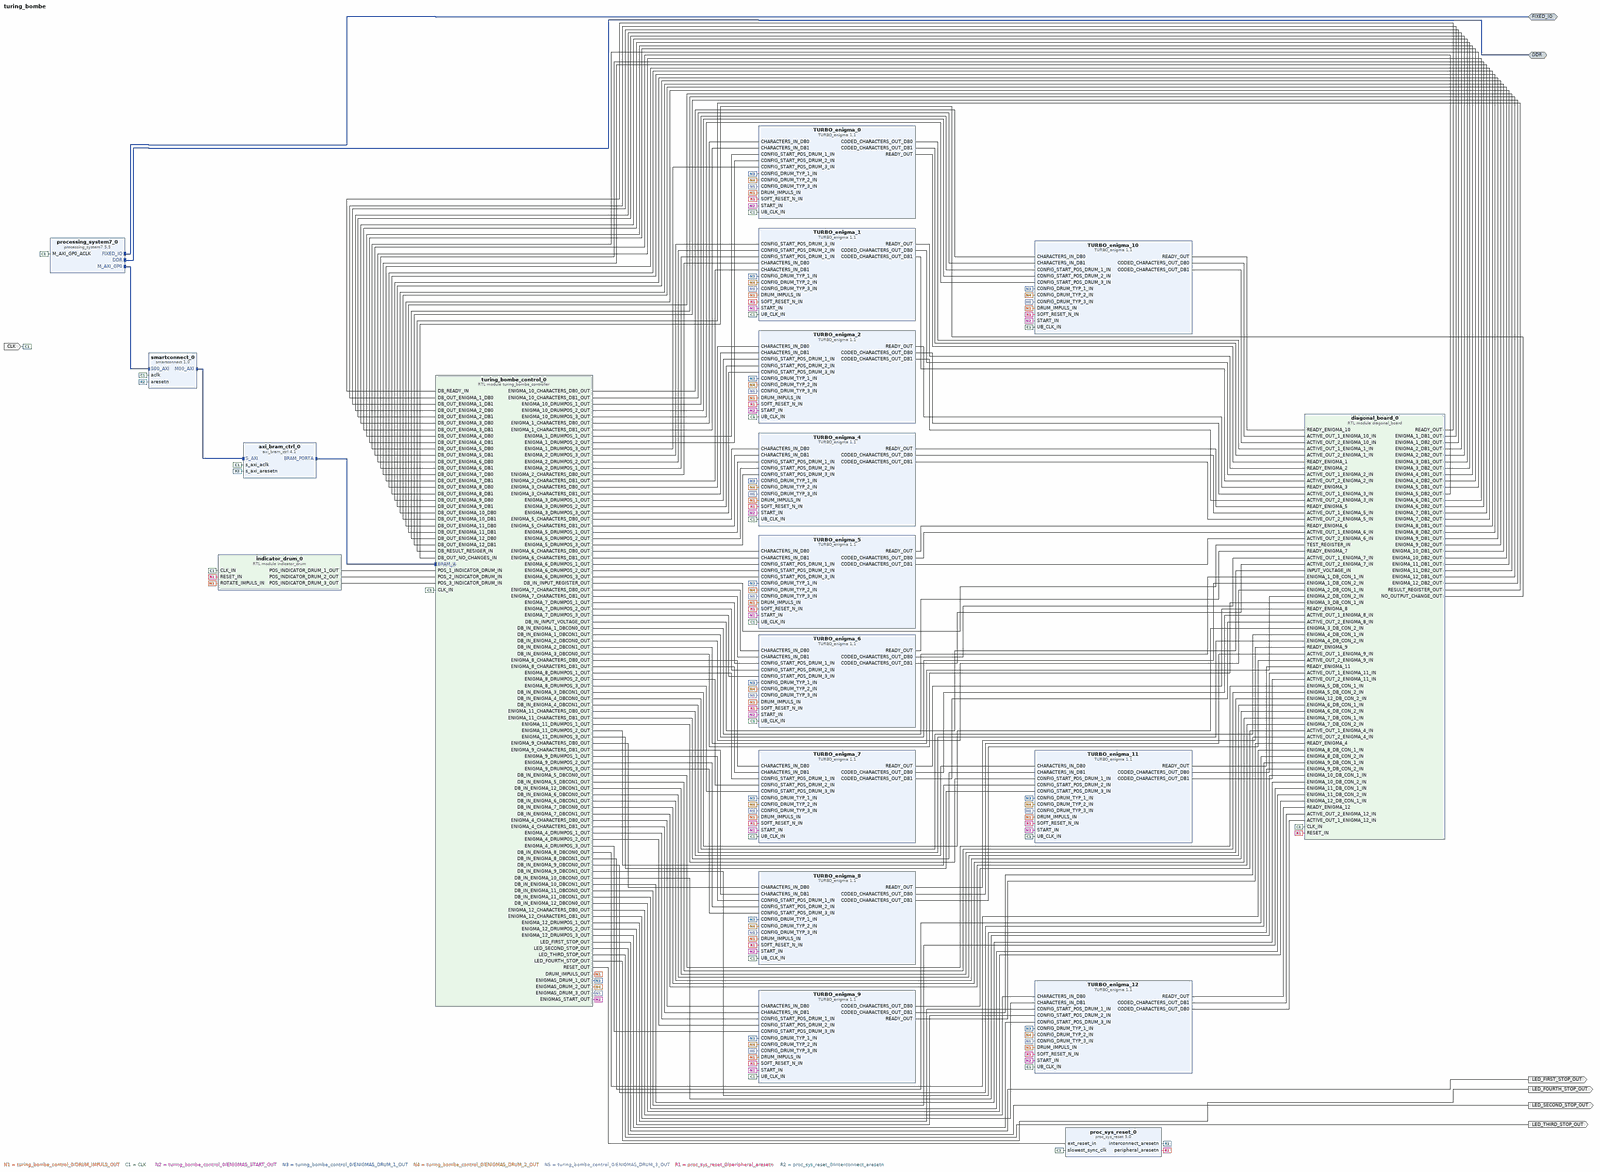
[diagram p0: block diagram of the top level, whole]
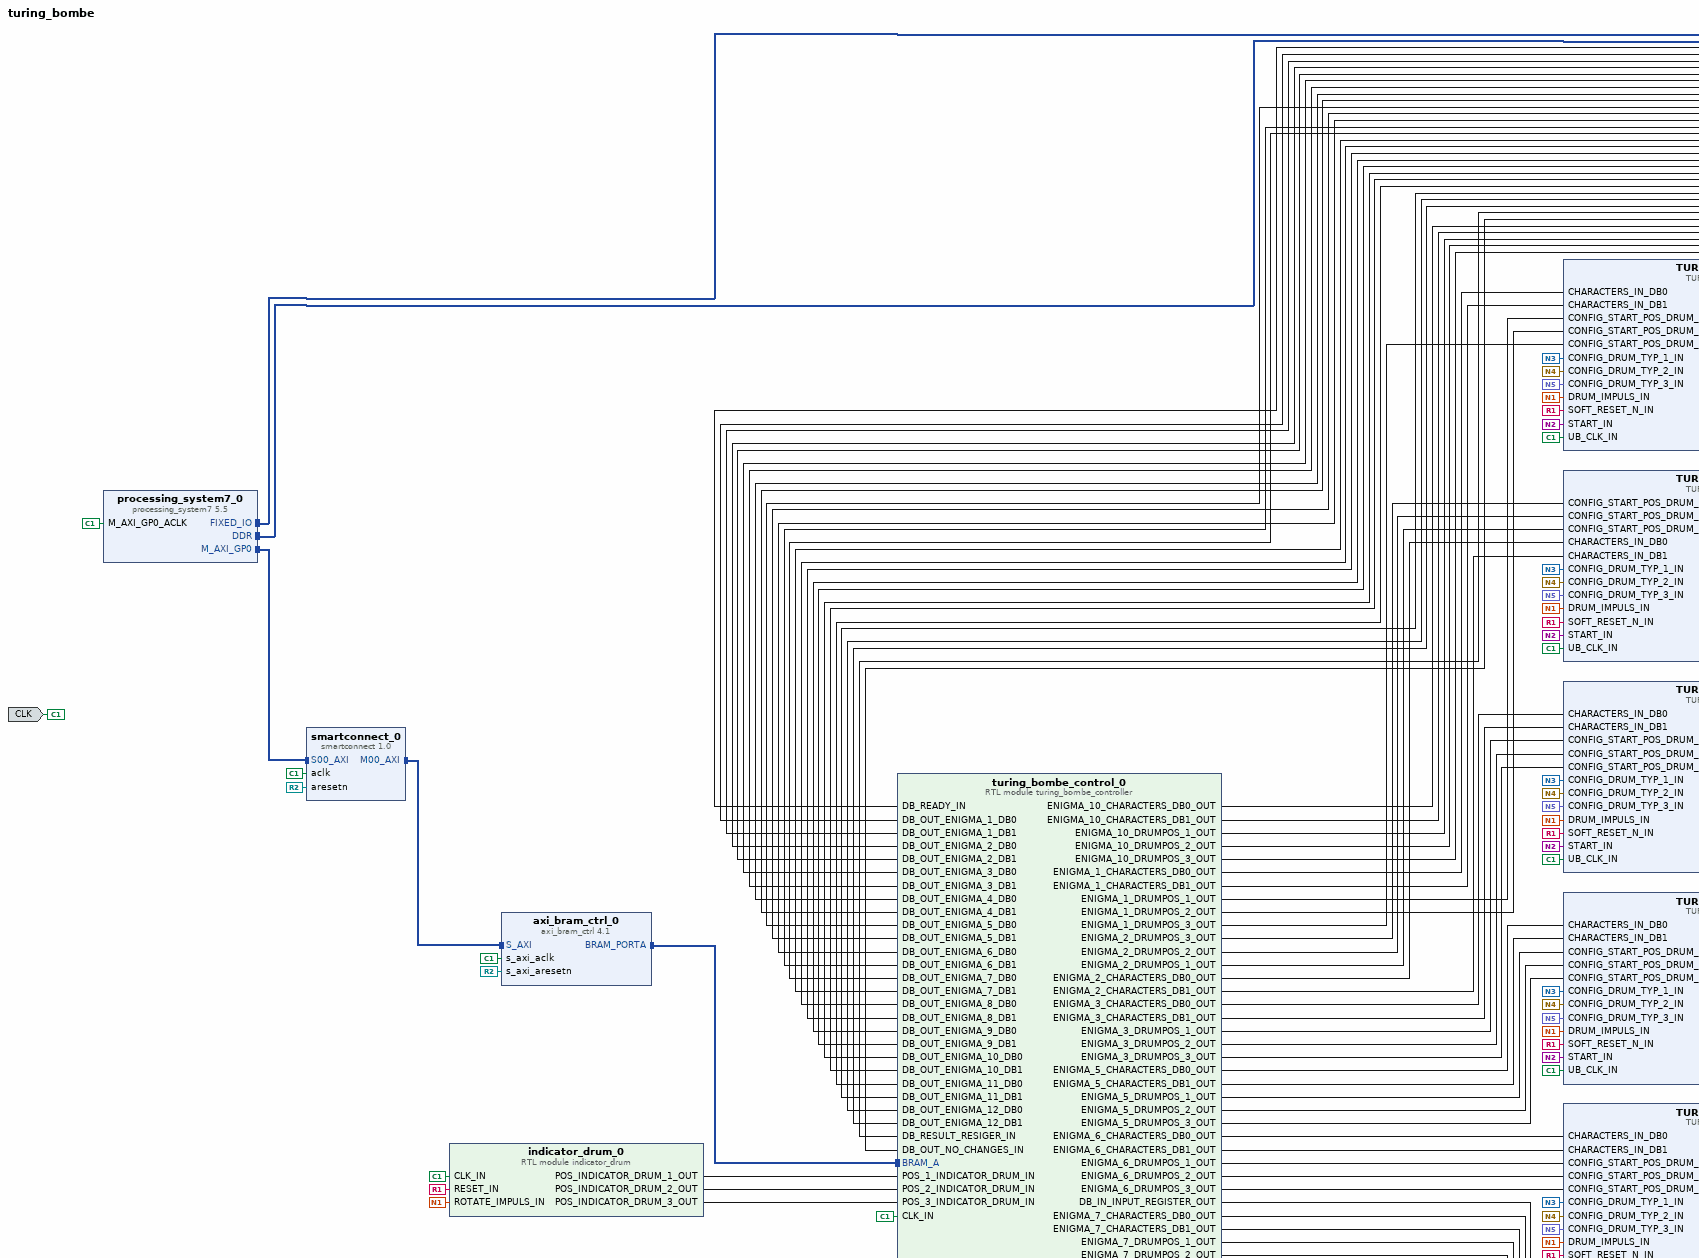
[diagram p1: block diagram of the top level, upper left part]
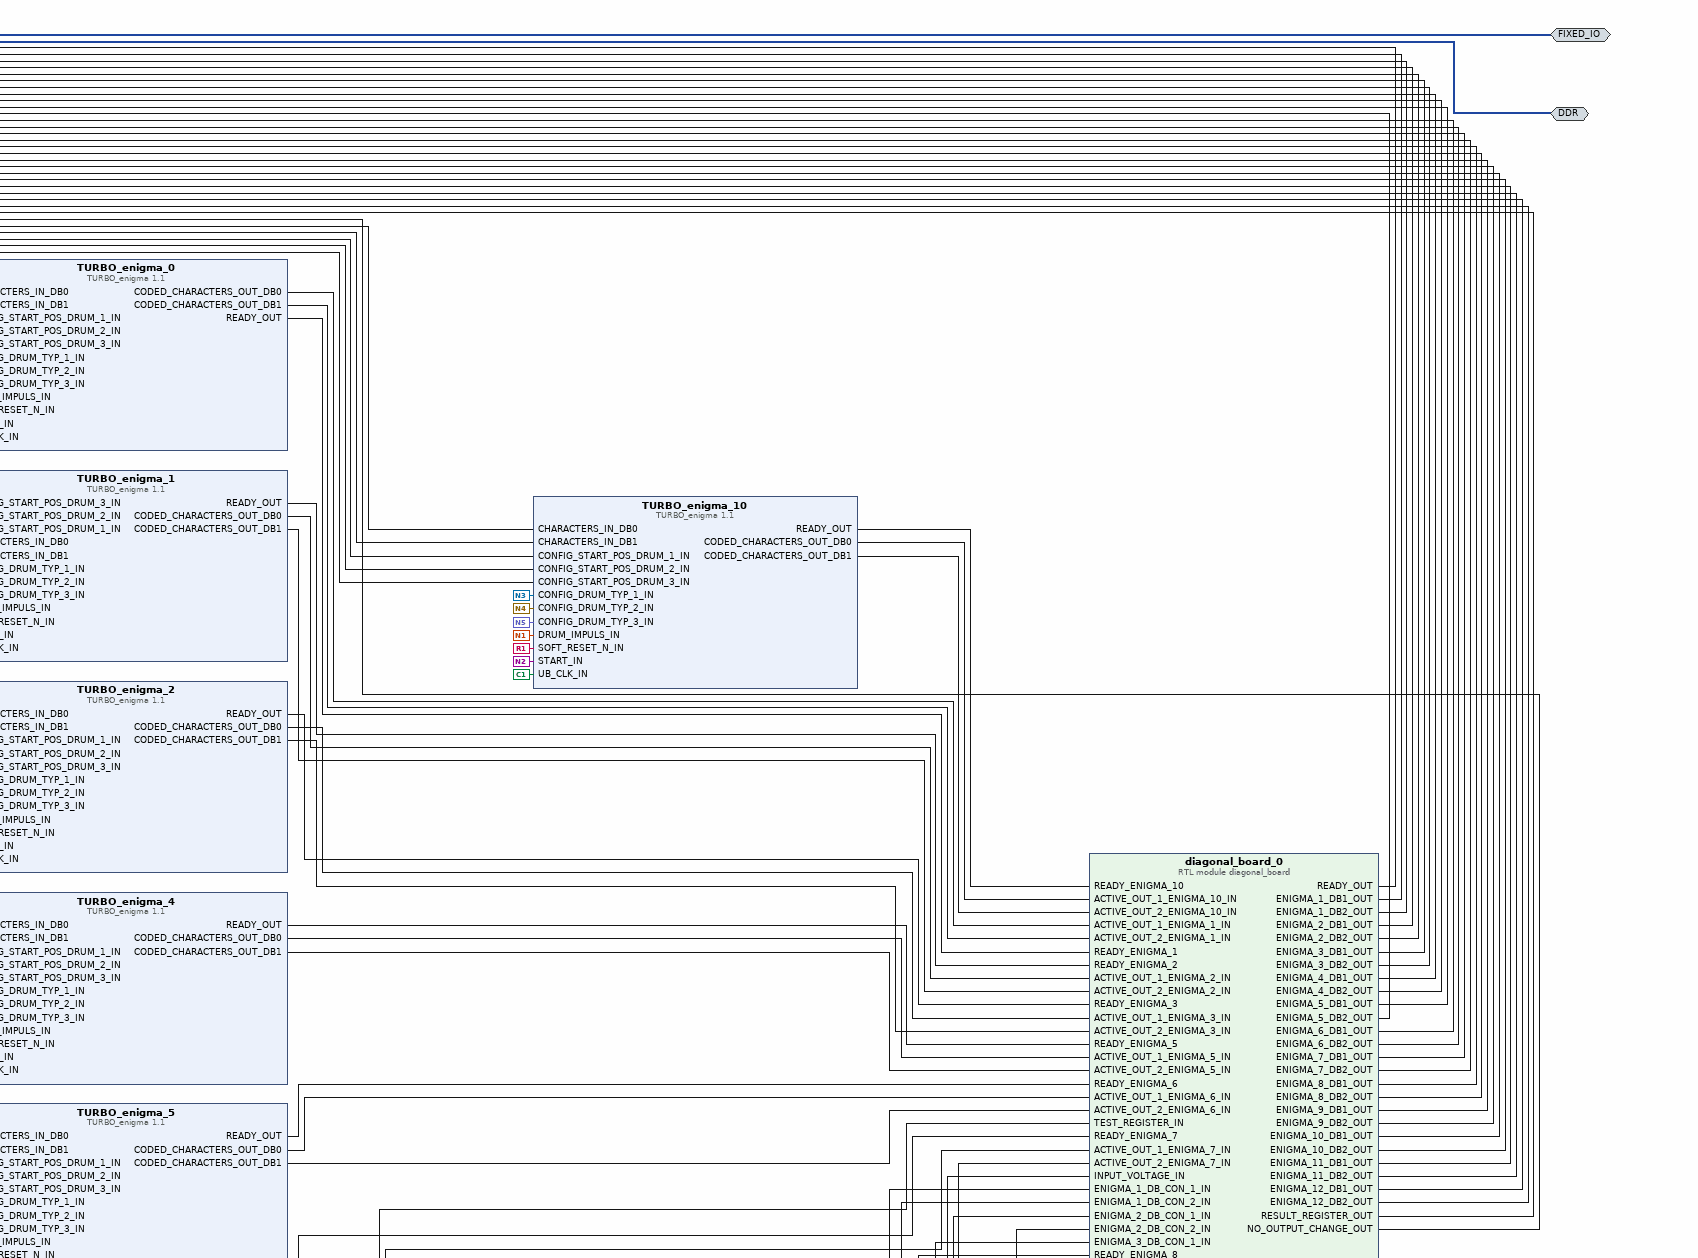
[diagram p2: block diagram of the top level, upper right part]
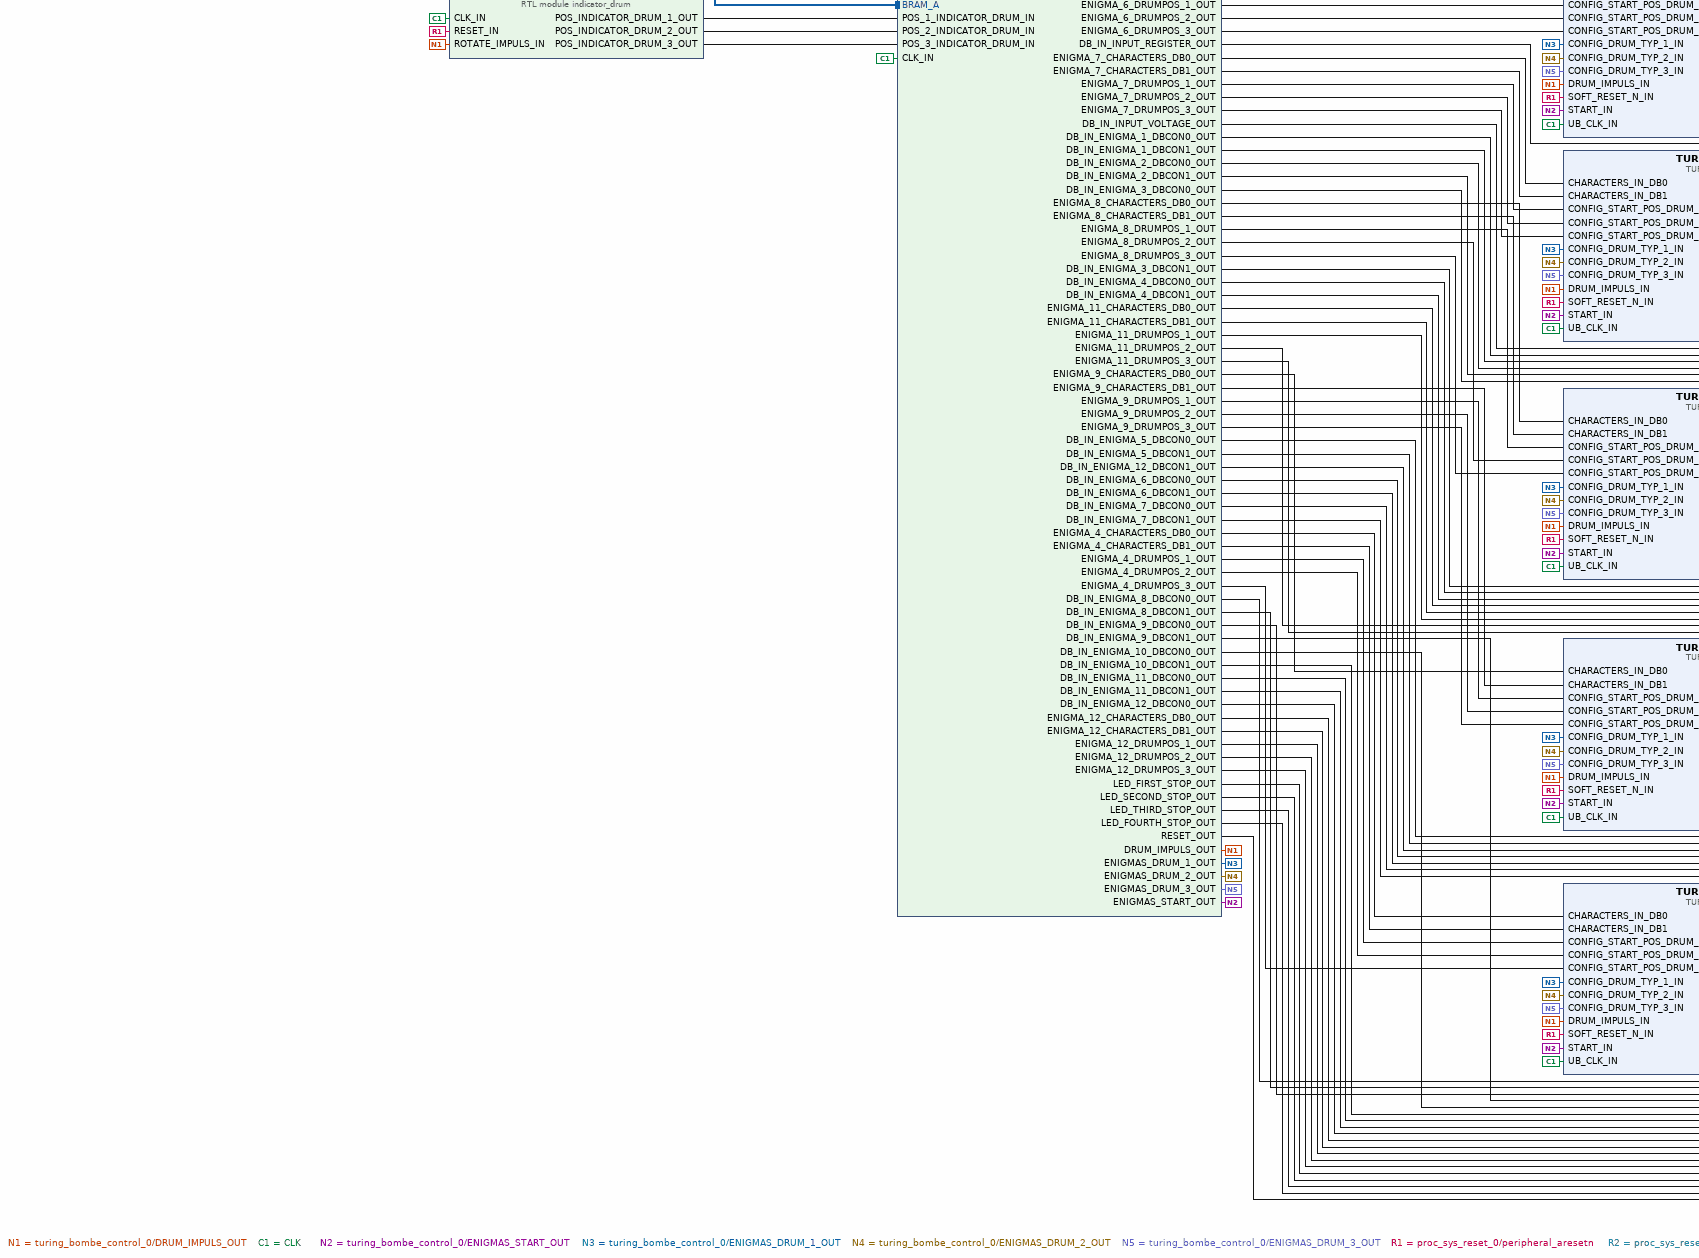
[diagram p3: block diagram of the top level, lower left part]
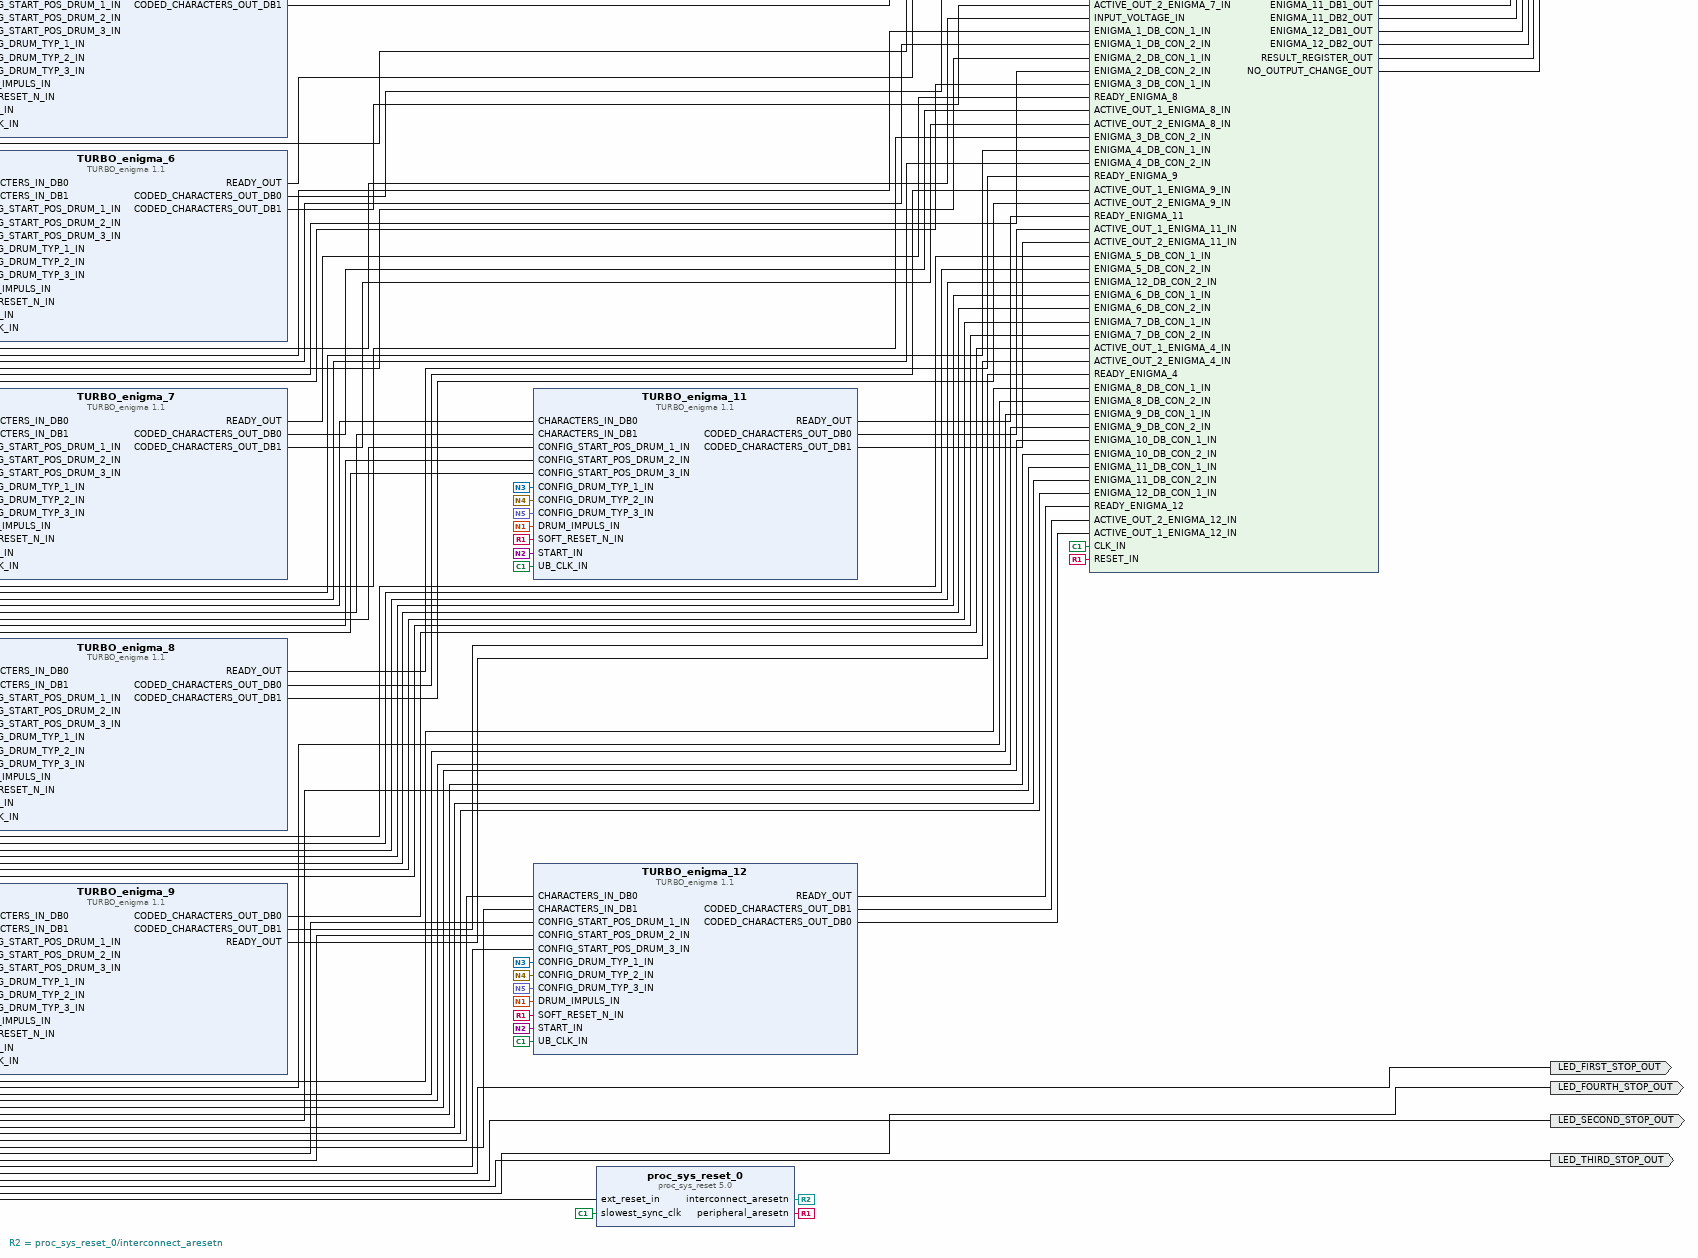
[diagram p4: block diagram of the top level, lower right part]
# Vivado block design turing_bombe, xc7z020clg400-1, Vivado 2018.3
create_bd_design turing_bombe

create_bd_intf_port -mode Master -vlnv xilinx.com:display_processing_system7:fixedio_rtl:1.0 FIXED_IO
create_bd_intf_port -mode Master -vlnv xilinx.com:interface:ddrx_rtl:1.0 DDR
create_bd_port -dir I -type clk CLK
set_property -dict {CONFIG.FREQ_HZ 50000000} [get_bd_ports CLK]
create_bd_port -dir O LED_FIRST_STOP_OUT
create_bd_port -dir O LED_SECOND_STOP_OUT
create_bd_port -dir O LED_THIRD_STOP_OUT
create_bd_port -dir O LED_FOURTH_STOP_OUT

create_bd_cell -type ip -vlnv xilinx.com:ip:axi_bram_ctrl:4.1 axi_bram_ctrl_0
set_property -dict {CONFIG.SINGLE_PORT_BRAM 1} [get_bd_cells axi_bram_ctrl_0]
create_bd_cell -type ip -vlnv xilinx.com:ip:smartconnect:1.0 smartconnect_0
set_property -dict {CONFIG.NUM_SI 1} [get_bd_cells smartconnect_0]
create_bd_cell -type ip -vlnv xilinx.com:ip:processing_system7:5.5 processing_system7_0
set_property -dict [list \
  CONFIG.PCW_APU_PERIPHERAL_FREQMHZ 666.666666 \
  CONFIG.PCW_ENET0_PERIPHERAL_ENABLE 0 \
  CONFIG.PCW_EN_CLK0_PORT 0 \
  CONFIG.PCW_FPGA0_PERIPHERAL_FREQMHZ 50 \
  CONFIG.PCW_FPGA1_PERIPHERAL_FREQMHZ 50 \
  CONFIG.PCW_GPIO_MIO_GPIO_ENABLE 0 \
  CONFIG.PCW_PERIPHERAL_BOARD_PRESET part0 \
  CONFIG.PCW_PRESET_BANK1_VOLTAGE {LVCMOS 3.3V} \
  CONFIG.PCW_QSPI_PERIPHERAL_ENABLE 0 \
  CONFIG.PCW_SD0_PERIPHERAL_ENABLE 0 \
  CONFIG.PCW_UART1_PERIPHERAL_ENABLE 1 \
  CONFIG.PCW_UART1_UART1_IO {MIO 48 .. 49} \
  CONFIG.PCW_UART_PERIPHERAL_FREQMHZ 100 \
  CONFIG.PCW_UIPARAM_DDR_FREQ_MHZ 533.333333 \
  CONFIG.PCW_UIPARAM_DDR_PARTNO {MT41J128M8 JP-125} \
  CONFIG.PCW_USB0_PERIPHERAL_ENABLE 0 \
] [get_bd_cells processing_system7_0]
# 341 more settings of processing_system7_0 are not shown: defaults, MIO pin electricals, DDR timing, and values the tool derives
create_bd_cell -type ip -vlnv xilinx.com:ip:proc_sys_reset:5.0 proc_sys_reset_0
create_bd_cell -type ip -vlnv user.org:user:TURBO_enigma:1.1 TURBO_enigma_0
create_bd_cell -type ip -vlnv user.org:user:TURBO_enigma:1.1 TURBO_enigma_1
create_bd_cell -type ip -vlnv user.org:user:TURBO_enigma:1.1 TURBO_enigma_2
create_bd_cell -type ip -vlnv user.org:user:TURBO_enigma:1.1 TURBO_enigma_4
create_bd_cell -type ip -vlnv user.org:user:TURBO_enigma:1.1 TURBO_enigma_5
create_bd_cell -type ip -vlnv user.org:user:TURBO_enigma:1.1 TURBO_enigma_7
create_bd_cell -type ip -vlnv user.org:user:TURBO_enigma:1.1 TURBO_enigma_8
create_bd_cell -type ip -vlnv user.org:user:TURBO_enigma:1.1 TURBO_enigma_10
create_bd_cell -type ip -vlnv user.org:user:TURBO_enigma:1.1 TURBO_enigma_9
create_bd_cell -type ip -vlnv user.org:user:TURBO_enigma:1.1 TURBO_enigma_6
create_bd_cell -type ip -vlnv user.org:user:TURBO_enigma:1.1 TURBO_enigma_11
create_bd_cell -type ip -vlnv user.org:user:TURBO_enigma:1.1 TURBO_enigma_12
create_bd_cell -type module -reference diagonal_board diagonal_board_0
create_bd_cell -type module -reference turing_bombe_controller turing_bombe_control_0
create_bd_cell -type module -reference indicator_drum indicator_drum_0

# ---- connections ----

connect_bd_intf_net [get_bd_intf_pins smartconnect_0/M00_AXI] [get_bd_intf_pins axi_bram_ctrl_0/S_AXI]
connect_bd_intf_net [get_bd_intf_pins axi_bram_ctrl_0/BRAM_PORTA] [get_bd_intf_pins turing_bombe_control_0/BRAM_A]
connect_bd_intf_net [get_bd_intf_ports FIXED_IO] [get_bd_intf_pins processing_system7_0/FIXED_IO]
connect_bd_intf_net [get_bd_intf_pins processing_system7_0/M_AXI_GP0] [get_bd_intf_pins smartconnect_0/S00_AXI]
connect_bd_intf_net [get_bd_intf_ports DDR] [get_bd_intf_pins processing_system7_0/DDR]
connect_bd_net [get_bd_pins diagonal_board_0/READY_OUT] [get_bd_pins turing_bombe_control_0/DB_READY_IN]
connect_bd_net [get_bd_pins indicator_drum_0/POS_INDICATOR_DRUM_1_OUT] [get_bd_pins turing_bombe_control_0/POS_1_INDICATOR_DRUM_IN]
connect_bd_net [get_bd_pins indicator_drum_0/POS_INDICATOR_DRUM_2_OUT] [get_bd_pins turing_bombe_control_0/POS_2_INDICATOR_DRUM_IN]
connect_bd_net [get_bd_pins indicator_drum_0/POS_INDICATOR_DRUM_3_OUT] [get_bd_pins turing_bombe_control_0/POS_3_INDICATOR_DRUM_IN]
connect_bd_net [get_bd_pins diagonal_board_0/ENIGMA_1_DB1_OUT] [get_bd_pins turing_bombe_control_0/DB_OUT_ENIGMA_1_DB0]
connect_bd_net [get_bd_pins diagonal_board_0/ENIGMA_1_DB2_OUT] [get_bd_pins turing_bombe_control_0/DB_OUT_ENIGMA_1_DB1]
connect_bd_net [get_bd_pins diagonal_board_0/ENIGMA_2_DB1_OUT] [get_bd_pins turing_bombe_control_0/DB_OUT_ENIGMA_2_DB0]
connect_bd_net [get_bd_pins diagonal_board_0/ENIGMA_2_DB2_OUT] [get_bd_pins turing_bombe_control_0/DB_OUT_ENIGMA_2_DB1]
connect_bd_net [get_bd_pins diagonal_board_0/ENIGMA_3_DB1_OUT] [get_bd_pins turing_bombe_control_0/DB_OUT_ENIGMA_3_DB0]
connect_bd_net [get_bd_pins diagonal_board_0/ENIGMA_3_DB2_OUT] [get_bd_pins turing_bombe_control_0/DB_OUT_ENIGMA_3_DB1]
connect_bd_net [get_bd_pins diagonal_board_0/ENIGMA_4_DB1_OUT] [get_bd_pins turing_bombe_control_0/DB_OUT_ENIGMA_4_DB0]
connect_bd_net [get_bd_pins diagonal_board_0/ENIGMA_4_DB2_OUT] [get_bd_pins turing_bombe_control_0/DB_OUT_ENIGMA_4_DB1]
connect_bd_net [get_bd_pins diagonal_board_0/ENIGMA_5_DB1_OUT] [get_bd_pins turing_bombe_control_0/DB_OUT_ENIGMA_5_DB0]
connect_bd_net [get_bd_pins diagonal_board_0/ENIGMA_5_DB2_OUT] [get_bd_pins turing_bombe_control_0/DB_OUT_ENIGMA_5_DB1]
connect_bd_net [get_bd_pins diagonal_board_0/ENIGMA_6_DB1_OUT] [get_bd_pins turing_bombe_control_0/DB_OUT_ENIGMA_6_DB0]
connect_bd_net [get_bd_pins diagonal_board_0/ENIGMA_6_DB2_OUT] [get_bd_pins turing_bombe_control_0/DB_OUT_ENIGMA_6_DB1]
connect_bd_net [get_bd_pins diagonal_board_0/ENIGMA_7_DB1_OUT] [get_bd_pins turing_bombe_control_0/DB_OUT_ENIGMA_7_DB0]
connect_bd_net [get_bd_pins diagonal_board_0/ENIGMA_7_DB2_OUT] [get_bd_pins turing_bombe_control_0/DB_OUT_ENIGMA_7_DB1]
connect_bd_net [get_bd_pins diagonal_board_0/ENIGMA_8_DB1_OUT] [get_bd_pins turing_bombe_control_0/DB_OUT_ENIGMA_8_DB0]
connect_bd_net [get_bd_pins diagonal_board_0/ENIGMA_8_DB2_OUT] [get_bd_pins turing_bombe_control_0/DB_OUT_ENIGMA_8_DB1]
connect_bd_net [get_bd_pins diagonal_board_0/ENIGMA_9_DB1_OUT] [get_bd_pins turing_bombe_control_0/DB_OUT_ENIGMA_9_DB0]
connect_bd_net [get_bd_pins diagonal_board_0/ENIGMA_9_DB2_OUT] [get_bd_pins turing_bombe_control_0/DB_OUT_ENIGMA_9_DB1]
connect_bd_net [get_bd_pins diagonal_board_0/ENIGMA_10_DB1_OUT] [get_bd_pins turing_bombe_control_0/DB_OUT_ENIGMA_10_DB0]
connect_bd_net [get_bd_pins diagonal_board_0/ENIGMA_10_DB2_OUT] [get_bd_pins turing_bombe_control_0/DB_OUT_ENIGMA_10_DB1]
connect_bd_net [get_bd_pins diagonal_board_0/ENIGMA_11_DB1_OUT] [get_bd_pins turing_bombe_control_0/DB_OUT_ENIGMA_11_DB0]
connect_bd_net [get_bd_pins diagonal_board_0/ENIGMA_11_DB2_OUT] [get_bd_pins turing_bombe_control_0/DB_OUT_ENIGMA_11_DB1]
connect_bd_net [get_bd_pins diagonal_board_0/ENIGMA_12_DB1_OUT] [get_bd_pins turing_bombe_control_0/DB_OUT_ENIGMA_12_DB0]
connect_bd_net [get_bd_pins diagonal_board_0/ENIGMA_12_DB2_OUT] [get_bd_pins turing_bombe_control_0/DB_OUT_ENIGMA_12_DB1]
connect_bd_net [get_bd_pins diagonal_board_0/RESULT_REGISTER_OUT] [get_bd_pins turing_bombe_control_0/DB_RESULT_RESIGER_IN]
connect_bd_net [get_bd_pins turing_bombe_control_0/DRUM_IMPULS_OUT] \
  [get_bd_pins TURBO_enigma_0/DRUM_IMPULS_IN] [get_bd_pins TURBO_enigma_1/DRUM_IMPULS_IN] \
  [get_bd_pins TURBO_enigma_2/DRUM_IMPULS_IN] [get_bd_pins TURBO_enigma_4/DRUM_IMPULS_IN] \
  [get_bd_pins TURBO_enigma_5/DRUM_IMPULS_IN] [get_bd_pins TURBO_enigma_7/DRUM_IMPULS_IN] \
  [get_bd_pins TURBO_enigma_8/DRUM_IMPULS_IN] [get_bd_pins TURBO_enigma_10/DRUM_IMPULS_IN] \
  [get_bd_pins TURBO_enigma_9/DRUM_IMPULS_IN] [get_bd_pins TURBO_enigma_6/DRUM_IMPULS_IN] \
  [get_bd_pins TURBO_enigma_11/DRUM_IMPULS_IN] [get_bd_pins TURBO_enigma_12/DRUM_IMPULS_IN] \
  [get_bd_pins indicator_drum_0/ROTATE_IMPULS_IN]
connect_bd_net [get_bd_pins turing_bombe_control_0/DB_IN_INPUT_REGISTER_OUT] [get_bd_pins diagonal_board_0/TEST_REGISTER_IN]
connect_bd_net [get_bd_pins turing_bombe_control_0/DB_IN_INPUT_VOLTAGE_OUT] [get_bd_pins diagonal_board_0/INPUT_VOLTAGE_IN]
connect_bd_net [get_bd_pins turing_bombe_control_0/DB_IN_ENIGMA_1_DBCON0_OUT] [get_bd_pins diagonal_board_0/ENIGMA_1_DB_CON_1_IN]
connect_bd_net [get_bd_pins turing_bombe_control_0/DB_IN_ENIGMA_1_DBCON1_OUT] [get_bd_pins diagonal_board_0/ENIGMA_1_DB_CON_2_IN]
connect_bd_net [get_bd_pins turing_bombe_control_0/DB_IN_ENIGMA_2_DBCON0_OUT] [get_bd_pins diagonal_board_0/ENIGMA_2_DB_CON_1_IN]
connect_bd_net [get_bd_pins turing_bombe_control_0/DB_IN_ENIGMA_2_DBCON1_OUT] [get_bd_pins diagonal_board_0/ENIGMA_2_DB_CON_2_IN]
connect_bd_net [get_bd_pins turing_bombe_control_0/DB_IN_ENIGMA_3_DBCON0_OUT] [get_bd_pins diagonal_board_0/ENIGMA_3_DB_CON_1_IN]
connect_bd_net [get_bd_pins turing_bombe_control_0/DB_IN_ENIGMA_3_DBCON1_OUT] [get_bd_pins diagonal_board_0/ENIGMA_3_DB_CON_2_IN]
connect_bd_net [get_bd_pins turing_bombe_control_0/DB_IN_ENIGMA_4_DBCON0_OUT] [get_bd_pins diagonal_board_0/ENIGMA_4_DB_CON_1_IN]
connect_bd_net [get_bd_pins turing_bombe_control_0/DB_IN_ENIGMA_4_DBCON1_OUT] [get_bd_pins diagonal_board_0/ENIGMA_4_DB_CON_2_IN]
connect_bd_net [get_bd_pins turing_bombe_control_0/DB_IN_ENIGMA_5_DBCON0_OUT] [get_bd_pins diagonal_board_0/ENIGMA_5_DB_CON_1_IN]
connect_bd_net [get_bd_pins turing_bombe_control_0/DB_IN_ENIGMA_5_DBCON1_OUT] [get_bd_pins diagonal_board_0/ENIGMA_5_DB_CON_2_IN]
connect_bd_net [get_bd_pins turing_bombe_control_0/DB_IN_ENIGMA_12_DBCON1_OUT] [get_bd_pins diagonal_board_0/ENIGMA_12_DB_CON_2_IN]
connect_bd_net [get_bd_pins turing_bombe_control_0/DB_IN_ENIGMA_6_DBCON0_OUT] [get_bd_pins diagonal_board_0/ENIGMA_6_DB_CON_1_IN]
connect_bd_net [get_bd_pins turing_bombe_control_0/DB_IN_ENIGMA_6_DBCON1_OUT] [get_bd_pins diagonal_board_0/ENIGMA_6_DB_CON_2_IN]
connect_bd_net [get_bd_pins turing_bombe_control_0/DB_IN_ENIGMA_7_DBCON0_OUT] [get_bd_pins diagonal_board_0/ENIGMA_7_DB_CON_1_IN]
connect_bd_net [get_bd_pins turing_bombe_control_0/DB_IN_ENIGMA_7_DBCON1_OUT] [get_bd_pins diagonal_board_0/ENIGMA_7_DB_CON_2_IN]
connect_bd_net [get_bd_pins turing_bombe_control_0/DB_IN_ENIGMA_8_DBCON0_OUT] [get_bd_pins diagonal_board_0/ENIGMA_8_DB_CON_1_IN]
connect_bd_net [get_bd_pins turing_bombe_control_0/DB_IN_ENIGMA_8_DBCON1_OUT] [get_bd_pins diagonal_board_0/ENIGMA_8_DB_CON_2_IN]
connect_bd_net [get_bd_pins turing_bombe_control_0/DB_IN_ENIGMA_9_DBCON0_OUT] [get_bd_pins diagonal_board_0/ENIGMA_9_DB_CON_1_IN]
connect_bd_net [get_bd_pins turing_bombe_control_0/DB_IN_ENIGMA_9_DBCON1_OUT] [get_bd_pins diagonal_board_0/ENIGMA_9_DB_CON_2_IN]
connect_bd_net [get_bd_pins turing_bombe_control_0/DB_IN_ENIGMA_10_DBCON0_OUT] [get_bd_pins diagonal_board_0/ENIGMA_10_DB_CON_1_IN]
connect_bd_net [get_bd_pins turing_bombe_control_0/DB_IN_ENIGMA_10_DBCON1_OUT] [get_bd_pins diagonal_board_0/ENIGMA_10_DB_CON_2_IN]
connect_bd_net [get_bd_pins turing_bombe_control_0/DB_IN_ENIGMA_11_DBCON0_OUT] [get_bd_pins diagonal_board_0/ENIGMA_11_DB_CON_1_IN]
connect_bd_net [get_bd_pins turing_bombe_control_0/DB_IN_ENIGMA_11_DBCON1_OUT] [get_bd_pins diagonal_board_0/ENIGMA_11_DB_CON_2_IN]
connect_bd_net [get_bd_pins turing_bombe_control_0/DB_IN_ENIGMA_12_DBCON0_OUT] [get_bd_pins diagonal_board_0/ENIGMA_12_DB_CON_1_IN]
connect_bd_net -net sim_clk_gen_0_clk [get_bd_ports CLK] \
  [get_bd_pins proc_sys_reset_0/slowest_sync_clk] [get_bd_pins processing_system7_0/M_AXI_GP0_ACLK] \
  [get_bd_pins smartconnect_0/aclk] [get_bd_pins axi_bram_ctrl_0/s_axi_aclk] [get_bd_pins TURBO_enigma_0/UB_CLK_IN] \
  [get_bd_pins TURBO_enigma_1/UB_CLK_IN] [get_bd_pins TURBO_enigma_2/UB_CLK_IN] [get_bd_pins TURBO_enigma_4/UB_CLK_IN] \
  [get_bd_pins TURBO_enigma_5/UB_CLK_IN] [get_bd_pins TURBO_enigma_7/UB_CLK_IN] [get_bd_pins TURBO_enigma_8/UB_CLK_IN] \
  [get_bd_pins TURBO_enigma_10/UB_CLK_IN] [get_bd_pins TURBO_enigma_9/UB_CLK_IN] [get_bd_pins TURBO_enigma_6/UB_CLK_IN] \
  [get_bd_pins TURBO_enigma_11/UB_CLK_IN] [get_bd_pins TURBO_enigma_12/UB_CLK_IN] [get_bd_pins diagonal_board_0/CLK_IN] \
  [get_bd_pins turing_bombe_control_0/CLK_IN] [get_bd_pins indicator_drum_0/CLK_IN]
connect_bd_net [get_bd_pins turing_bombe_control_0/ENIGMAS_START_OUT] \
  [get_bd_pins TURBO_enigma_0/START_IN] [get_bd_pins TURBO_enigma_1/START_IN] [get_bd_pins TURBO_enigma_2/START_IN] \
  [get_bd_pins TURBO_enigma_4/START_IN] [get_bd_pins TURBO_enigma_5/START_IN] [get_bd_pins TURBO_enigma_7/START_IN] \
  [get_bd_pins TURBO_enigma_8/START_IN] [get_bd_pins TURBO_enigma_10/START_IN] [get_bd_pins TURBO_enigma_9/START_IN] \
  [get_bd_pins TURBO_enigma_6/START_IN] [get_bd_pins TURBO_enigma_11/START_IN] [get_bd_pins TURBO_enigma_12/START_IN]
connect_bd_net [get_bd_pins diagonal_board_0/NO_OUTPUT_CHANGE_OUT] [get_bd_pins turing_bombe_control_0/DB_OUT_NO_CHANGES_IN]
connect_bd_net [get_bd_pins turing_bombe_control_0/ENIGMA_1_CHARACTERS_DB0_OUT] [get_bd_pins TURBO_enigma_0/CHARACTERS_IN_DB0]
connect_bd_net [get_bd_pins turing_bombe_control_0/ENIGMA_1_CHARACTERS_DB1_OUT] [get_bd_pins TURBO_enigma_0/CHARACTERS_IN_DB1]
connect_bd_net [get_bd_pins turing_bombe_control_0/ENIGMA_1_DRUMPOS_1_OUT] [get_bd_pins TURBO_enigma_0/CONFIG_START_POS_DRUM_1_IN]
connect_bd_net [get_bd_pins turing_bombe_control_0/ENIGMA_1_DRUMPOS_2_OUT] [get_bd_pins TURBO_enigma_0/CONFIG_START_POS_DRUM_2_IN]
connect_bd_net [get_bd_pins turing_bombe_control_0/ENIGMA_1_DRUMPOS_3_OUT] [get_bd_pins TURBO_enigma_0/CONFIG_START_POS_DRUM_3_IN]
connect_bd_net [get_bd_pins turing_bombe_control_0/ENIGMAS_DRUM_1_OUT] \
  [get_bd_pins TURBO_enigma_0/CONFIG_DRUM_TYP_1_IN] [get_bd_pins TURBO_enigma_1/CONFIG_DRUM_TYP_1_IN] \
  [get_bd_pins TURBO_enigma_2/CONFIG_DRUM_TYP_1_IN] [get_bd_pins TURBO_enigma_4/CONFIG_DRUM_TYP_1_IN] \
  [get_bd_pins TURBO_enigma_5/CONFIG_DRUM_TYP_1_IN] [get_bd_pins TURBO_enigma_7/CONFIG_DRUM_TYP_1_IN] \
  [get_bd_pins TURBO_enigma_8/CONFIG_DRUM_TYP_1_IN] [get_bd_pins TURBO_enigma_10/CONFIG_DRUM_TYP_1_IN] \
  [get_bd_pins TURBO_enigma_9/CONFIG_DRUM_TYP_1_IN] [get_bd_pins TURBO_enigma_6/CONFIG_DRUM_TYP_1_IN] \
  [get_bd_pins TURBO_enigma_11/CONFIG_DRUM_TYP_1_IN] [get_bd_pins TURBO_enigma_12/CONFIG_DRUM_TYP_1_IN]
connect_bd_net [get_bd_pins turing_bombe_control_0/ENIGMAS_DRUM_2_OUT] \
  [get_bd_pins TURBO_enigma_0/CONFIG_DRUM_TYP_2_IN] [get_bd_pins TURBO_enigma_1/CONFIG_DRUM_TYP_2_IN] \
  [get_bd_pins TURBO_enigma_2/CONFIG_DRUM_TYP_2_IN] [get_bd_pins TURBO_enigma_4/CONFIG_DRUM_TYP_2_IN] \
  [get_bd_pins TURBO_enigma_5/CONFIG_DRUM_TYP_2_IN] [get_bd_pins TURBO_enigma_7/CONFIG_DRUM_TYP_2_IN] \
  [get_bd_pins TURBO_enigma_8/CONFIG_DRUM_TYP_2_IN] [get_bd_pins TURBO_enigma_10/CONFIG_DRUM_TYP_2_IN] \
  [get_bd_pins TURBO_enigma_9/CONFIG_DRUM_TYP_2_IN] [get_bd_pins TURBO_enigma_6/CONFIG_DRUM_TYP_2_IN] \
  [get_bd_pins TURBO_enigma_11/CONFIG_DRUM_TYP_2_IN] [get_bd_pins TURBO_enigma_12/CONFIG_DRUM_TYP_2_IN]
connect_bd_net [get_bd_pins turing_bombe_control_0/ENIGMAS_DRUM_3_OUT] \
  [get_bd_pins TURBO_enigma_0/CONFIG_DRUM_TYP_3_IN] [get_bd_pins TURBO_enigma_1/CONFIG_DRUM_TYP_3_IN] \
  [get_bd_pins TURBO_enigma_2/CONFIG_DRUM_TYP_3_IN] [get_bd_pins TURBO_enigma_4/CONFIG_DRUM_TYP_3_IN] \
  [get_bd_pins TURBO_enigma_5/CONFIG_DRUM_TYP_3_IN] [get_bd_pins TURBO_enigma_7/CONFIG_DRUM_TYP_3_IN] \
  [get_bd_pins TURBO_enigma_8/CONFIG_DRUM_TYP_3_IN] [get_bd_pins TURBO_enigma_10/CONFIG_DRUM_TYP_3_IN] \
  [get_bd_pins TURBO_enigma_9/CONFIG_DRUM_TYP_3_IN] [get_bd_pins TURBO_enigma_6/CONFIG_DRUM_TYP_3_IN] \
  [get_bd_pins TURBO_enigma_11/CONFIG_DRUM_TYP_3_IN] [get_bd_pins TURBO_enigma_12/CONFIG_DRUM_TYP_3_IN]
connect_bd_net [get_bd_pins TURBO_enigma_0/CODED_CHARACTERS_OUT_DB0] [get_bd_pins diagonal_board_0/ACTIVE_OUT_1_ENIGMA_1_IN]
connect_bd_net [get_bd_pins TURBO_enigma_0/CODED_CHARACTERS_OUT_DB1] [get_bd_pins diagonal_board_0/ACTIVE_OUT_2_ENIGMA_1_IN]
connect_bd_net [get_bd_pins TURBO_enigma_0/READY_OUT] [get_bd_pins diagonal_board_0/READY_ENIGMA_1]
connect_bd_net [get_bd_pins turing_bombe_control_0/ENIGMA_2_DRUMPOS_3_OUT] [get_bd_pins TURBO_enigma_1/CONFIG_START_POS_DRUM_3_IN]
connect_bd_net [get_bd_pins turing_bombe_control_0/ENIGMA_2_DRUMPOS_2_OUT] [get_bd_pins TURBO_enigma_1/CONFIG_START_POS_DRUM_2_IN]
connect_bd_net [get_bd_pins turing_bombe_control_0/ENIGMA_2_DRUMPOS_1_OUT] [get_bd_pins TURBO_enigma_1/CONFIG_START_POS_DRUM_1_IN]
connect_bd_net [get_bd_pins turing_bombe_control_0/ENIGMA_2_CHARACTERS_DB0_OUT] [get_bd_pins TURBO_enigma_1/CHARACTERS_IN_DB0]
connect_bd_net [get_bd_pins turing_bombe_control_0/ENIGMA_2_CHARACTERS_DB1_OUT] [get_bd_pins TURBO_enigma_1/CHARACTERS_IN_DB1]
connect_bd_net [get_bd_pins turing_bombe_control_0/ENIGMA_3_CHARACTERS_DB0_OUT] [get_bd_pins TURBO_enigma_2/CHARACTERS_IN_DB0]
connect_bd_net [get_bd_pins turing_bombe_control_0/ENIGMA_3_CHARACTERS_DB1_OUT] [get_bd_pins TURBO_enigma_2/CHARACTERS_IN_DB1]
connect_bd_net [get_bd_pins turing_bombe_control_0/ENIGMA_3_DRUMPOS_1_OUT] [get_bd_pins TURBO_enigma_2/CONFIG_START_POS_DRUM_1_IN]
connect_bd_net [get_bd_pins turing_bombe_control_0/ENIGMA_3_DRUMPOS_2_OUT] [get_bd_pins TURBO_enigma_2/CONFIG_START_POS_DRUM_2_IN]
connect_bd_net [get_bd_pins turing_bombe_control_0/ENIGMA_3_DRUMPOS_3_OUT] [get_bd_pins TURBO_enigma_2/CONFIG_START_POS_DRUM_3_IN]
connect_bd_net [get_bd_pins turing_bombe_control_0/ENIGMA_5_CHARACTERS_DB0_OUT] [get_bd_pins TURBO_enigma_4/CHARACTERS_IN_DB0]
connect_bd_net [get_bd_pins turing_bombe_control_0/ENIGMA_5_CHARACTERS_DB1_OUT] [get_bd_pins TURBO_enigma_4/CHARACTERS_IN_DB1]
connect_bd_net [get_bd_pins turing_bombe_control_0/ENIGMA_5_DRUMPOS_1_OUT] [get_bd_pins TURBO_enigma_4/CONFIG_START_POS_DRUM_1_IN]
connect_bd_net [get_bd_pins turing_bombe_control_0/ENIGMA_5_DRUMPOS_2_OUT] [get_bd_pins TURBO_enigma_4/CONFIG_START_POS_DRUM_2_IN]
connect_bd_net [get_bd_pins turing_bombe_control_0/ENIGMA_5_DRUMPOS_3_OUT] [get_bd_pins TURBO_enigma_4/CONFIG_START_POS_DRUM_3_IN]
connect_bd_net [get_bd_pins turing_bombe_control_0/ENIGMA_6_CHARACTERS_DB0_OUT] [get_bd_pins TURBO_enigma_5/CHARACTERS_IN_DB0]
connect_bd_net [get_bd_pins turing_bombe_control_0/ENIGMA_6_CHARACTERS_DB1_OUT] [get_bd_pins TURBO_enigma_5/CHARACTERS_IN_DB1]
connect_bd_net [get_bd_pins turing_bombe_control_0/ENIGMA_6_DRUMPOS_1_OUT] [get_bd_pins TURBO_enigma_5/CONFIG_START_POS_DRUM_1_IN]
connect_bd_net [get_bd_pins turing_bombe_control_0/ENIGMA_6_DRUMPOS_2_OUT] [get_bd_pins TURBO_enigma_5/CONFIG_START_POS_DRUM_2_IN]
connect_bd_net [get_bd_pins turing_bombe_control_0/ENIGMA_6_DRUMPOS_3_OUT] [get_bd_pins TURBO_enigma_5/CONFIG_START_POS_DRUM_3_IN]
connect_bd_net [get_bd_pins turing_bombe_control_0/ENIGMA_7_CHARACTERS_DB0_OUT] [get_bd_pins TURBO_enigma_6/CHARACTERS_IN_DB0]
connect_bd_net [get_bd_pins turing_bombe_control_0/ENIGMA_7_CHARACTERS_DB1_OUT] [get_bd_pins TURBO_enigma_6/CHARACTERS_IN_DB1]
connect_bd_net [get_bd_pins turing_bombe_control_0/ENIGMA_7_DRUMPOS_1_OUT] [get_bd_pins TURBO_enigma_6/CONFIG_START_POS_DRUM_1_IN]
connect_bd_net [get_bd_pins turing_bombe_control_0/ENIGMA_7_DRUMPOS_2_OUT] [get_bd_pins TURBO_enigma_6/CONFIG_START_POS_DRUM_2_IN]
connect_bd_net [get_bd_pins turing_bombe_control_0/ENIGMA_7_DRUMPOS_3_OUT] [get_bd_pins TURBO_enigma_6/CONFIG_START_POS_DRUM_3_IN]
connect_bd_net [get_bd_pins turing_bombe_control_0/ENIGMA_8_CHARACTERS_DB0_OUT] [get_bd_pins TURBO_enigma_7/CHARACTERS_IN_DB0]
connect_bd_net [get_bd_pins turing_bombe_control_0/ENIGMA_8_CHARACTERS_DB1_OUT] [get_bd_pins TURBO_enigma_7/CHARACTERS_IN_DB1]
connect_bd_net [get_bd_pins turing_bombe_control_0/ENIGMA_8_DRUMPOS_1_OUT] [get_bd_pins TURBO_enigma_7/CONFIG_START_POS_DRUM_1_IN]
connect_bd_net [get_bd_pins turing_bombe_control_0/ENIGMA_8_DRUMPOS_2_OUT] [get_bd_pins TURBO_enigma_7/CONFIG_START_POS_DRUM_2_IN]
connect_bd_net [get_bd_pins turing_bombe_control_0/ENIGMA_8_DRUMPOS_3_OUT] [get_bd_pins TURBO_enigma_7/CONFIG_START_POS_DRUM_3_IN]
connect_bd_net [get_bd_pins turing_bombe_control_0/ENIGMA_9_CHARACTERS_DB0_OUT] [get_bd_pins TURBO_enigma_8/CHARACTERS_IN_DB0]
connect_bd_net [get_bd_pins turing_bombe_control_0/ENIGMA_9_CHARACTERS_DB1_OUT] [get_bd_pins TURBO_enigma_8/CHARACTERS_IN_DB1]
connect_bd_net [get_bd_pins turing_bombe_control_0/ENIGMA_9_DRUMPOS_1_OUT] [get_bd_pins TURBO_enigma_8/CONFIG_START_POS_DRUM_1_IN]
connect_bd_net [get_bd_pins turing_bombe_control_0/ENIGMA_9_DRUMPOS_2_OUT] [get_bd_pins TURBO_enigma_8/CONFIG_START_POS_DRUM_2_IN]
connect_bd_net [get_bd_pins turing_bombe_control_0/ENIGMA_9_DRUMPOS_3_OUT] [get_bd_pins TURBO_enigma_8/CONFIG_START_POS_DRUM_3_IN]
connect_bd_net [get_bd_pins turing_bombe_control_0/ENIGMA_10_CHARACTERS_DB0_OUT] [get_bd_pins TURBO_enigma_10/CHARACTERS_IN_DB0]
connect_bd_net [get_bd_pins turing_bombe_control_0/ENIGMA_10_CHARACTERS_DB1_OUT] [get_bd_pins TURBO_enigma_10/CHARACTERS_IN_DB1]
connect_bd_net [get_bd_pins turing_bombe_control_0/ENIGMA_10_DRUMPOS_1_OUT] [get_bd_pins TURBO_enigma_10/CONFIG_START_POS_DRUM_1_IN]
connect_bd_net [get_bd_pins turing_bombe_control_0/ENIGMA_10_DRUMPOS_2_OUT] [get_bd_pins TURBO_enigma_10/CONFIG_START_POS_DRUM_2_IN]
connect_bd_net [get_bd_pins turing_bombe_control_0/ENIGMA_10_DRUMPOS_3_OUT] [get_bd_pins TURBO_enigma_10/CONFIG_START_POS_DRUM_3_IN]
connect_bd_net [get_bd_pins turing_bombe_control_0/ENIGMA_11_CHARACTERS_DB0_OUT] [get_bd_pins TURBO_enigma_11/CHARACTERS_IN_DB0]
connect_bd_net [get_bd_pins turing_bombe_control_0/ENIGMA_11_CHARACTERS_DB1_OUT] [get_bd_pins TURBO_enigma_11/CHARACTERS_IN_DB1]
connect_bd_net [get_bd_pins turing_bombe_control_0/ENIGMA_11_DRUMPOS_1_OUT] [get_bd_pins TURBO_enigma_11/CONFIG_START_POS_DRUM_1_IN]
connect_bd_net [get_bd_pins turing_bombe_control_0/ENIGMA_11_DRUMPOS_2_OUT] [get_bd_pins TURBO_enigma_11/CONFIG_START_POS_DRUM_2_IN]
connect_bd_net [get_bd_pins turing_bombe_control_0/ENIGMA_11_DRUMPOS_3_OUT] [get_bd_pins TURBO_enigma_11/CONFIG_START_POS_DRUM_3_IN]
connect_bd_net [get_bd_pins turing_bombe_control_0/ENIGMA_12_CHARACTERS_DB0_OUT] [get_bd_pins TURBO_enigma_12/CHARACTERS_IN_DB0]
connect_bd_net [get_bd_pins turing_bombe_control_0/ENIGMA_12_CHARACTERS_DB1_OUT] [get_bd_pins TURBO_enigma_12/CHARACTERS_IN_DB1]
connect_bd_net [get_bd_pins turing_bombe_control_0/ENIGMA_12_DRUMPOS_1_OUT] [get_bd_pins TURBO_enigma_12/CONFIG_START_POS_DRUM_1_IN]
connect_bd_net [get_bd_pins turing_bombe_control_0/ENIGMA_12_DRUMPOS_2_OUT] [get_bd_pins TURBO_enigma_12/CONFIG_START_POS_DRUM_2_IN]
connect_bd_net [get_bd_pins turing_bombe_control_0/ENIGMA_12_DRUMPOS_3_OUT] [get_bd_pins TURBO_enigma_12/CONFIG_START_POS_DRUM_3_IN]
connect_bd_net [get_bd_pins TURBO_enigma_1/READY_OUT] [get_bd_pins diagonal_board_0/READY_ENIGMA_2]
connect_bd_net [get_bd_pins TURBO_enigma_2/READY_OUT] [get_bd_pins diagonal_board_0/READY_ENIGMA_3]
connect_bd_net [get_bd_pins TURBO_enigma_4/READY_OUT] [get_bd_pins diagonal_board_0/READY_ENIGMA_5]
connect_bd_net [get_bd_pins TURBO_enigma_5/READY_OUT] [get_bd_pins diagonal_board_0/READY_ENIGMA_6]
connect_bd_net [get_bd_pins TURBO_enigma_6/READY_OUT] [get_bd_pins diagonal_board_0/READY_ENIGMA_7]
connect_bd_net [get_bd_pins TURBO_enigma_7/READY_OUT] [get_bd_pins diagonal_board_0/READY_ENIGMA_8]
connect_bd_net [get_bd_pins TURBO_enigma_8/READY_OUT] [get_bd_pins diagonal_board_0/READY_ENIGMA_9]
connect_bd_net [get_bd_pins TURBO_enigma_10/READY_OUT] [get_bd_pins diagonal_board_0/READY_ENIGMA_10]
connect_bd_net [get_bd_pins TURBO_enigma_11/READY_OUT] [get_bd_pins diagonal_board_0/READY_ENIGMA_11]
connect_bd_net [get_bd_pins TURBO_enigma_12/READY_OUT] [get_bd_pins diagonal_board_0/READY_ENIGMA_12]
connect_bd_net [get_bd_pins TURBO_enigma_12/CODED_CHARACTERS_OUT_DB1] [get_bd_pins diagonal_board_0/ACTIVE_OUT_2_ENIGMA_12_IN]
connect_bd_net [get_bd_pins TURBO_enigma_12/CODED_CHARACTERS_OUT_DB0] [get_bd_pins diagonal_board_0/ACTIVE_OUT_1_ENIGMA_12_IN]
connect_bd_net [get_bd_pins TURBO_enigma_1/CODED_CHARACTERS_OUT_DB0] [get_bd_pins diagonal_board_0/ACTIVE_OUT_1_ENIGMA_2_IN]
connect_bd_net [get_bd_pins TURBO_enigma_1/CODED_CHARACTERS_OUT_DB1] [get_bd_pins diagonal_board_0/ACTIVE_OUT_2_ENIGMA_2_IN]
connect_bd_net [get_bd_pins TURBO_enigma_2/CODED_CHARACTERS_OUT_DB0] [get_bd_pins diagonal_board_0/ACTIVE_OUT_1_ENIGMA_3_IN]
connect_bd_net [get_bd_pins TURBO_enigma_2/CODED_CHARACTERS_OUT_DB1] [get_bd_pins diagonal_board_0/ACTIVE_OUT_2_ENIGMA_3_IN]
connect_bd_net [get_bd_pins TURBO_enigma_4/CODED_CHARACTERS_OUT_DB0] [get_bd_pins diagonal_board_0/ACTIVE_OUT_1_ENIGMA_5_IN]
connect_bd_net [get_bd_pins TURBO_enigma_4/CODED_CHARACTERS_OUT_DB1] [get_bd_pins diagonal_board_0/ACTIVE_OUT_2_ENIGMA_5_IN]
connect_bd_net [get_bd_pins TURBO_enigma_5/CODED_CHARACTERS_OUT_DB0] [get_bd_pins diagonal_board_0/ACTIVE_OUT_1_ENIGMA_6_IN]
connect_bd_net [get_bd_pins TURBO_enigma_5/CODED_CHARACTERS_OUT_DB1] [get_bd_pins diagonal_board_0/ACTIVE_OUT_2_ENIGMA_6_IN]
connect_bd_net [get_bd_pins TURBO_enigma_6/CODED_CHARACTERS_OUT_DB0] [get_bd_pins diagonal_board_0/ACTIVE_OUT_1_ENIGMA_7_IN]
connect_bd_net [get_bd_pins TURBO_enigma_6/CODED_CHARACTERS_OUT_DB1] [get_bd_pins diagonal_board_0/ACTIVE_OUT_2_ENIGMA_7_IN]
connect_bd_net [get_bd_pins TURBO_enigma_7/CODED_CHARACTERS_OUT_DB0] [get_bd_pins diagonal_board_0/ACTIVE_OUT_1_ENIGMA_8_IN]
connect_bd_net [get_bd_pins TURBO_enigma_7/CODED_CHARACTERS_OUT_DB1] [get_bd_pins diagonal_board_0/ACTIVE_OUT_2_ENIGMA_8_IN]
connect_bd_net [get_bd_pins TURBO_enigma_8/CODED_CHARACTERS_OUT_DB0] [get_bd_pins diagonal_board_0/ACTIVE_OUT_1_ENIGMA_9_IN]
connect_bd_net [get_bd_pins TURBO_enigma_8/CODED_CHARACTERS_OUT_DB1] [get_bd_pins diagonal_board_0/ACTIVE_OUT_2_ENIGMA_9_IN]
connect_bd_net [get_bd_pins TURBO_enigma_10/CODED_CHARACTERS_OUT_DB0] [get_bd_pins diagonal_board_0/ACTIVE_OUT_1_ENIGMA_10_IN]
connect_bd_net [get_bd_pins TURBO_enigma_10/CODED_CHARACTERS_OUT_DB1] [get_bd_pins diagonal_board_0/ACTIVE_OUT_2_ENIGMA_10_IN]
connect_bd_net [get_bd_pins TURBO_enigma_11/CODED_CHARACTERS_OUT_DB0] [get_bd_pins diagonal_board_0/ACTIVE_OUT_1_ENIGMA_11_IN]
connect_bd_net [get_bd_pins TURBO_enigma_11/CODED_CHARACTERS_OUT_DB1] [get_bd_pins diagonal_board_0/ACTIVE_OUT_2_ENIGMA_11_IN]
connect_bd_net -net turing_bombe_control_0_RESET_ENIGMAS_OUT [get_bd_pins proc_sys_reset_0/peripheral_aresetn] \
  [get_bd_pins TURBO_enigma_0/SOFT_RESET_N_IN] [get_bd_pins TURBO_enigma_1/SOFT_RESET_N_IN] \
  [get_bd_pins TURBO_enigma_2/SOFT_RESET_N_IN] [get_bd_pins TURBO_enigma_4/SOFT_RESET_N_IN] \
  [get_bd_pins TURBO_enigma_5/SOFT_RESET_N_IN] [get_bd_pins TURBO_enigma_7/SOFT_RESET_N_IN] \
  [get_bd_pins TURBO_enigma_8/SOFT_RESET_N_IN] [get_bd_pins TURBO_enigma_10/SOFT_RESET_N_IN] \
  [get_bd_pins TURBO_enigma_9/SOFT_RESET_N_IN] [get_bd_pins TURBO_enigma_6/SOFT_RESET_N_IN] \
  [get_bd_pins TURBO_enigma_11/SOFT_RESET_N_IN] [get_bd_pins TURBO_enigma_12/SOFT_RESET_N_IN] \
  [get_bd_pins diagonal_board_0/RESET_IN] [get_bd_pins indicator_drum_0/RESET_IN]
connect_bd_net [get_bd_pins turing_bombe_control_0/ENIGMA_4_CHARACTERS_DB0_OUT] [get_bd_pins TURBO_enigma_9/CHARACTERS_IN_DB0]
connect_bd_net [get_bd_pins turing_bombe_control_0/ENIGMA_4_CHARACTERS_DB1_OUT] [get_bd_pins TURBO_enigma_9/CHARACTERS_IN_DB1]
connect_bd_net [get_bd_pins turing_bombe_control_0/ENIGMA_4_DRUMPOS_1_OUT] [get_bd_pins TURBO_enigma_9/CONFIG_START_POS_DRUM_1_IN]
connect_bd_net [get_bd_pins turing_bombe_control_0/ENIGMA_4_DRUMPOS_2_OUT] [get_bd_pins TURBO_enigma_9/CONFIG_START_POS_DRUM_2_IN]
connect_bd_net [get_bd_pins turing_bombe_control_0/ENIGMA_4_DRUMPOS_3_OUT] [get_bd_pins TURBO_enigma_9/CONFIG_START_POS_DRUM_3_IN]
connect_bd_net [get_bd_pins TURBO_enigma_9/CODED_CHARACTERS_OUT_DB0] [get_bd_pins diagonal_board_0/ACTIVE_OUT_1_ENIGMA_4_IN]
connect_bd_net [get_bd_pins TURBO_enigma_9/CODED_CHARACTERS_OUT_DB1] [get_bd_pins diagonal_board_0/ACTIVE_OUT_2_ENIGMA_4_IN]
connect_bd_net [get_bd_pins TURBO_enigma_9/READY_OUT] [get_bd_pins diagonal_board_0/READY_ENIGMA_4]
connect_bd_net -net proc_sys_reset_0_peripheral_aresetn [get_bd_pins proc_sys_reset_0/interconnect_aresetn] \
  [get_bd_pins axi_bram_ctrl_0/s_axi_aresetn] [get_bd_pins smartconnect_0/aresetn]
connect_bd_net [get_bd_pins turing_bombe_control_0/LED_FIRST_STOP_OUT] [get_bd_ports LED_FIRST_STOP_OUT]
connect_bd_net [get_bd_pins turing_bombe_control_0/LED_SECOND_STOP_OUT] [get_bd_ports LED_SECOND_STOP_OUT]
connect_bd_net [get_bd_pins turing_bombe_control_0/LED_THIRD_STOP_OUT] [get_bd_ports LED_THIRD_STOP_OUT]
connect_bd_net [get_bd_pins turing_bombe_control_0/LED_FOURTH_STOP_OUT] [get_bd_ports LED_FOURTH_STOP_OUT]
connect_bd_net [get_bd_pins turing_bombe_control_0/RESET_OUT] [get_bd_pins proc_sys_reset_0/ext_reset_in]

# ---- address map ----
assign_bd_address -offset 0x40000000 -range 8K -target_address_space [get_bd_addr_spaces processing_system7_0/Data] [get_bd_addr_segs axi_bram_ctrl_0/S_AXI/Mem0]

validate_bd_design
save_bd_design
